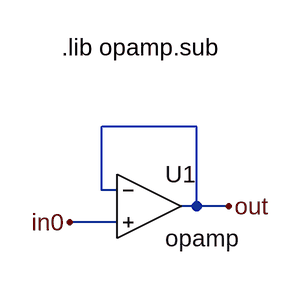
[diagram p0: schematic buffer.asc]
buffer.asc, the LTspice schematic file:
Version 4
SHEET 1 880 680
WIRE -80 48 -176 48
WIRE -176 112 -176 48
WIRE -160 112 -176 112
WIRE -80 128 -80 48
WIRE -80 128 -96 128
WIRE -48 128 -80 128
WIRE -160 144 -208 144
FLAG -208 144 in0
FLAG -48 128 out
SYMBOL OpAmps/opamp -128 64 R0
SYMATTR InstName U1
TEXT -216 -32 Left 2 !.lib opamp.sub

The netlist it stands for:
* buffer.asc
XU1 out in0 out opamp Aol=100K GBW=10Meg  ; pins invin noninvin out
.lib opamp.sub
.backanno
.end